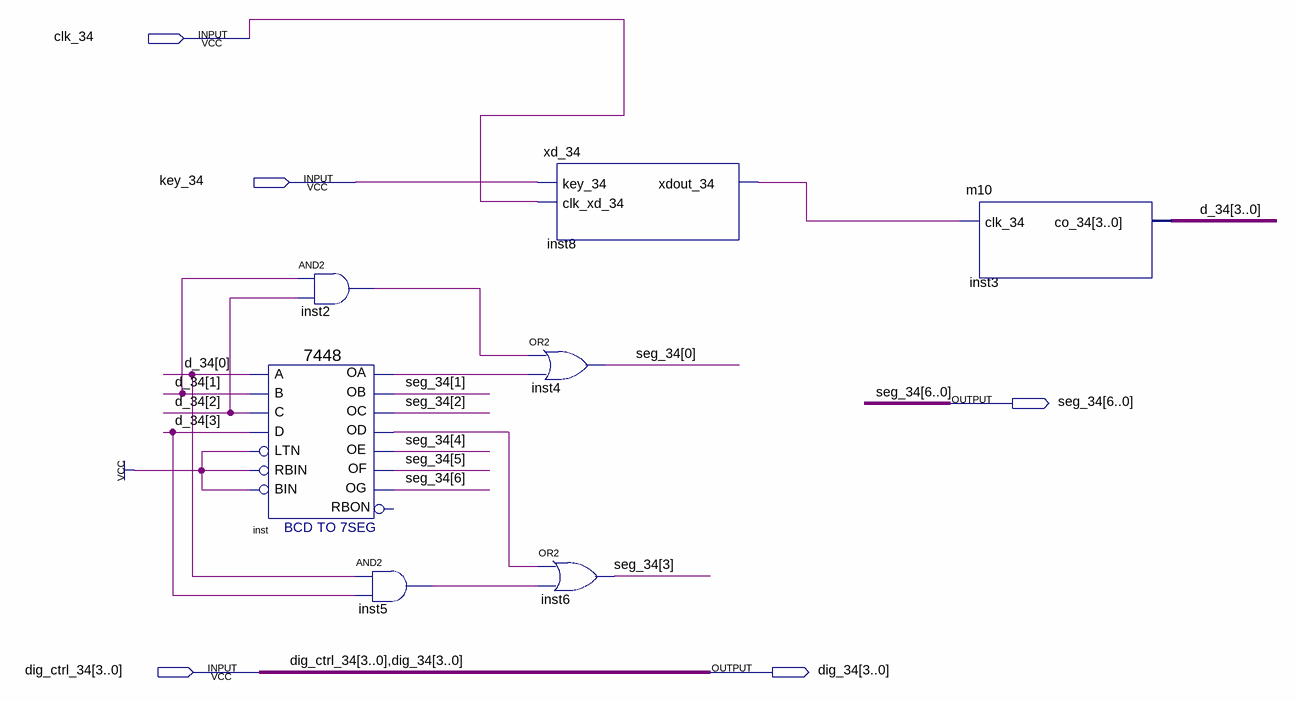
[diagram p0: schematic sheet]
// Quartus schematic demo2_fz_34.bdf as structural Verilog: 7 symbols, 5 pins
module demo2_fz_34 (
  input  clk_34,
  input  key_34,
  input  [3:0] dig_ctrl_34,
  output [6:0] seg_34,
  output [3:0] dig_34
);

  wire inst2_out, inst5_out, inst8_xdout_34, inst_oa, inst_od;
  wire [3:0] d_34;

  \7448  inst (
    .A(d_34[0]), .C(d_34[2]), .D(d_34[3]), .B(d_34[1]), .RBIN(1'b1), .BIN(1'b1), .LTN(1'b1), .OC(seg_34[2]),
    .OE(seg_34[4]), .OD(inst_od), .OF(seg_34[5]), .OG(seg_34[6]), .OB(seg_34[1]), .OA(inst_oa));  // open: RBON
  and inst2 (inst2_out, d_34[1], d_34[2]);
  and inst5 (inst5_out, d_34[0], d_34[3]);
  xd_34 inst8 (.key_34(key_34), .clk_xd_34(clk_34), .xdout_34(inst8_xdout_34));
  or inst4 (seg_34[0], inst2_out, inst_oa);
  or inst6 (seg_34[3], inst_od, inst5_out);
  m10 inst3 (.clk_34(inst8_xdout_34), .co_34(d_34));
endmodule
